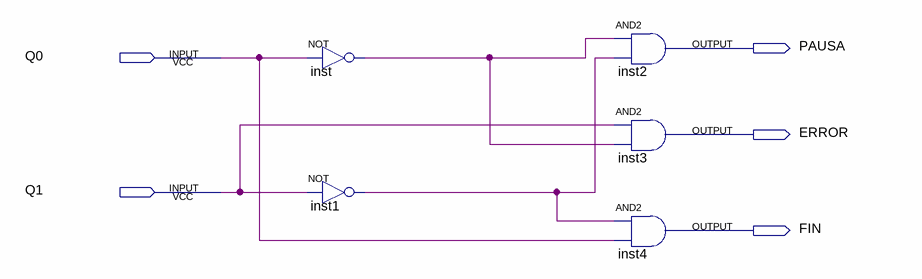
[diagram p0: schematic sheet]
// Quartus schematic UC_de_estados.bdf as structural Verilog: 5 symbols, 5 pins
module UC_de_estados (
  input  Q0,
  input  Q1,
  output PAUSA,
  output ERROR,
  output FIN
);

  wire inst1_out, inst_out;

  not inst (inst_out, Q0);
  not inst1 (inst1_out, Q1);
  and inst2 (PAUSA, inst_out, inst1_out);
  and inst3 (ERROR, Q1, inst_out);
  and inst4 (FIN, inst1_out, Q0);
endmodule
